# EAGLE design USB C Vertical Breakout-PTH (EAGLE 9.6.2)
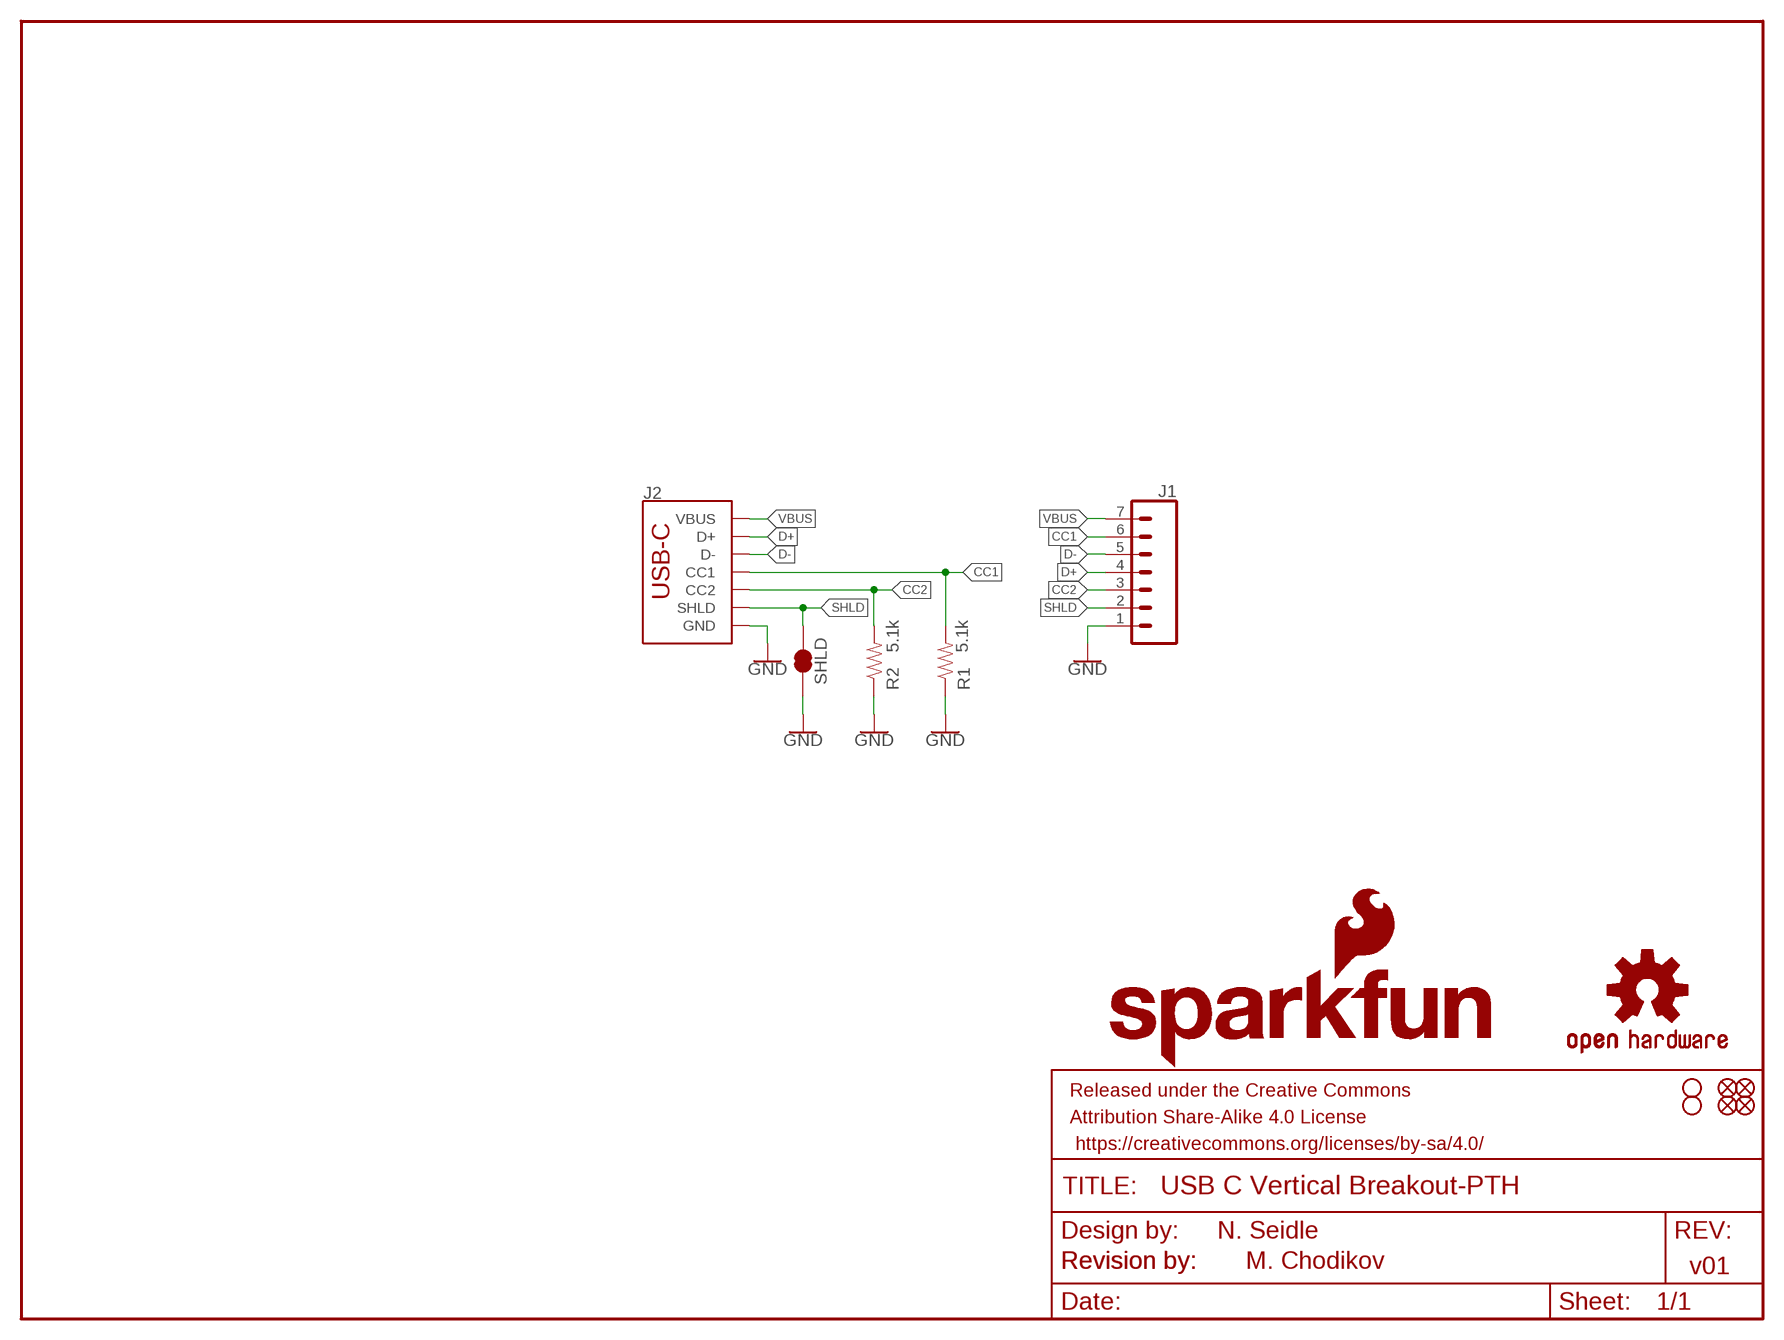
[diagram p0: schematic, sheet 1]

## Parts
FD1  FIDUCIALUFIDUCIAL  [FIDUCIAL-MICRO]
FD2  FIDUCIALUFIDUCIAL  [FIDUCIAL-MICRO]
FD3  FIDUCIALUFIDUCIAL  [FIDUCIAL-MICRO]
FD4  FIDUCIALUFIDUCIAL  [FIDUCIAL-MICRO]
FRAME2  FRAME-LETTER  [CREATIVE_COMMONS]
H1  STAND-OFFTIGHT  [STAND-OFF-TIGHT]
H2  STAND-OFFTIGHT  [STAND-OFF-TIGHT]
J1  CONN_07NO_SILK  [1X07_NO_SILK]
J2  USB_C_2-LAYER-VERTICAL-PTH  [USB-C-8P-2LAYER-VERTICAL-PTH]
LOGO1  SFE_LOGO_NAME_FLAMEBLANK  [BLANK]
LOGO2  OSHW-LOGOMINI  [OSHW-LOGO-MINI]
LOGO3  SFE_LOGO_FLAME.1_INCH  [SFE_LOGO_FLAME_.1]
R1  5.1k  5.1KOHM5.1KOHM-0603-1/10W-1%  [0603]
R2  5.1k  5.1KOHM5.1KOHM-0603-1/10W-1%  [0603]
SHLD  SHLD  JUMPER-SMT_2_NC_TRACE_NO-SILK  [SMT-JUMPER_2_NC_TRACE_NO-SILK]

## Nets
CC1: J1.6 J2.A5(CC1) R1.2
CC2: J1.3 J2.B5(CC2) R2.2
D+: J1.4 J2.A6(D+) J2.B6(D+)
D-: J1.5 J2.A7(D-) J2.B7(D-)
GND: J1.1 J2.A1(GND) J2.A12(GND) J2.B1(GND) J2.B12(GND) R1.1 R2.1 SHLD.1
SHLD: J1.2 J2.SHLD1(SHLD) J2.SHLD2(SHLD) J2.SHLD3(SHLD) J2.SHLD4(SHLD) SHLD.2
VBUS: J1.7 J2.A4(VBUS) J2.A9(VBUS) J2.B4(VBUS) J2.B9(VBUS)

## Notes on the sheet
- N. Seidle
- Revision by: | Revision by: | M. Chodikov | v01

## Library data of the parts
FD1-FD4 = SparkFun-Aesthetics:FIDUCIAL: Fiducial Alignment Points Point-of-reference for pick-and-place machines and other optical instruments.
FRAME2 = SparkFun-Aesthetics:FRAME-LETTER: Schematic Frame - Letter Standard 8.5x11 US Letter frame
H1 H2 = SparkFun-Hardware:STAND-OFF: Stand Off Drill holes for mechanically mounting via screws, standoffs, etc. Note: Use the keepout ring to avoid running the screw head into surrounding components. Variant Overviews STAND-OFF - Mechanical footprint for a #4 phillips button head screw. STAND-OFF-TIGHT - Mechanical footprint for a #4 phillips button head screw, Example SparkFun Products Screw - Phillips Head (1/4", 4-40, 10 pack) <https://www.sparkfun.com/products/10453> (PRT-10453) Screw - Phillips Head (1/2", 4-40, 10 pack) <https://www.sparkfun.com/products/10452> (PRT-10452) Screw - Phillips Head (3/4", 4-40, 10 pack) <https://www.sparkfun.com/products/10451> (PRT-10451) Screw - Phillips Head (1", 4-40, 10 pack) <https://www.sparkfun.com/products/10450> (PRT-10450)
J1 = SparkFun-Connectors:CONN_07: Multi connection point. Often used as Generic Header-pin footprint for 0.1 inch spaced/style header connections On any of the 0.1 inch spaced packages, you can populate with these: Break Away Headers - Straight <https://www.sparkfun.com/products/116> (PRT-00116) Break Away Male Headers - Right Angle <https://www.sparkfun.com/products/553> (PRT-00553) Female Headers <https://www.sparkfun.com/products/115> (PRT-00115) Break Away Headers - Machine Pin <https://www.sparkfun.com/products/117> (PRT-00117) Break Away Female Headers - Swiss Machine Pin <https://www.sparkfun.com/products/743> (PRT-00743) For SCREWTERMINALS and SPRING TERMINALS visit here: Screw Terimnals on SparkFun.com <https://www.sparkfun.com/search/results?term=Screw+Terminals> (5mm/3.5mm/2.54mm spacing) This device is also useful as a general connection point to wire up your design to another part of your project. Our various solder wires solder well into these plated through hole pads. Hook-Up Wire - Assortment (Stranded, 22 AWG) <https://www.sparkfun.com/products/11375> (PRT-11375) Hook-Up Wire - Assortment (Solid Core, 22 AWG) <https://www.sparkfun.com/products/11367> (PRT-11367) View the entire wire category on our website here <https://www.sparkfun.com/categories/141> Special notes: Molex polarized connector foot print use with SKU : PRT-08231 with associated crimp pins and housings. 1MM SMD Version SKU: PRT-10208 NOTES ON THE VARIANTS LOCK and LOCK_LONGPADS... This footprint was designed to help hold the alignment of a through-hole component (i.e. 6-pin header) while soldering it into place. You may notice that each hole has been shifted either up or down by 0.005 of an inch from it's more standard position (which is a perfectly straight line). This slight alteration caused the pins (the squares in the middle) to touch the edges of the holes. Because they are alternating, it causes a "brace" to hold the component in place. 0.005 has proven to be the perfect amount of "off-center" position when using our standard breakaway headers. Although looks a little odd when you look at the bare footprint, once you have a header in there, the alteration is very hard to notice. Also,if you push a header all the way into place, it is covered up entirely on the bottom side.
J2 = USB-C_Vertical:USB_C: USB Type C 14Pin Connector D1 and D2 are tied together enabling D+/- no matter which way the cable is plugged into the connector. The two channel configuration pins (CC1/2) are exposed. These are normally connected to ground via 5.1k resistors but can be reconfigured for high current/high power applications. **4-LAYER BOARD WARNING!!** If designing 4-layer board, make sure to select the variant _4-LAYER-ISOLATED. The linked footprint (USB-C-16-4LAYER-ISOLATED) includes some very necessary cutout polygons in the inner layers (2 and 15). This prevents the PTH mounting shield legs on the USB connector from electrically connecting any other polygons on the inner layers (usually VCC and GND).; PROD_ID: CONN-19461
LOGO1 = SparkFun-Aesthetics:SFE_LOGO_NAME_FLAME: SparkFun Font Logo w/ Flame This is the SparkFun full logo. The logo on the schematic will always be the same size; the package variant is the height of the flame part of the logo. Default layer for the logo on the board is tSilk.
LOGO2 = SparkFun-Aesthetics:OSHW-LOGO: Open-Source Hardware (OSHW) Logo This logo indicates the piece of hardware it is found on incorporates a OSHW license and/or adheres to the definition of open source hardware found here: http://freedomdefined.org/OSHW
LOGO3 = SparkFun-Aesthetics:SFE_LOGO_FLAME: SparkFun Flame Logo This is the SparkFun flame logo. The logo on the schematic will always be the same size; the package variant is the height of the flame. Default layer for the logo on the board is tSilk.
R1 R2 = SparkFun-Resistors:5.1KOHM; PROD_ID: RES-12083
SHLD = SparkFun-Jumpers:JUMPER-SMT_2_NC_TRACE: Normally closed trace jumper This jumper has a trace between two pads so it's normally closed (NC). Use a razor knife to open the connection. For best results follow the IPC guidelines for cutting traces: Cutout at least 0.063 mm (0.005 in). Remove all loose material to clean up the cut area. Seal the cut with an approved epoxy. Reapply solder to reclose the connection.

## Net classes
0 default: width 0 mm, drill 0 mm
1 power: width 0.178 mm

## Board
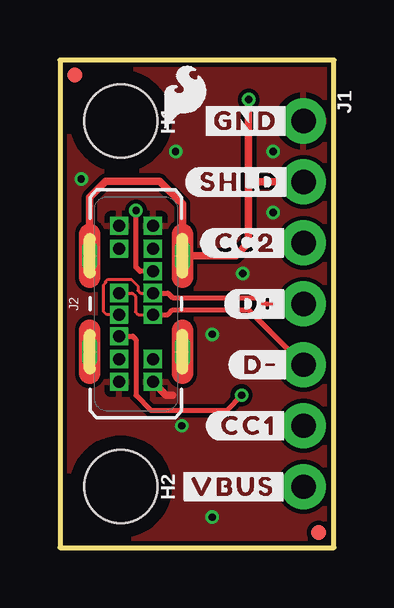
[diagram p1: board, top side]
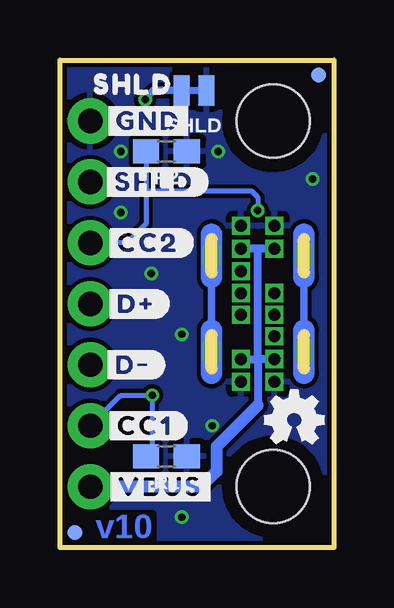
[diagram p2: board, bottom side, seen from below]

Size 11.43 x 20.32 mm. Coordinates in mm from the lower left corner, seen from the top.
Outline: 0,0 11.43,0 11.43,20.32 0,20.32 0,0
Copper layers (1*16): Top/Horz 0.035mm / dielectric 1.5mm / Bottom/Vert 0.035mm
Design rules "SparkFun-2-Layer-Minimum-JLCPCB": minimum track width 5mil, minimum drill 0.3mm, track to track 5mil, track to pad 5mil, pad to pad 5mil, via to via 5mil, smd to smd 5mil, copper to edge 7mil, drill to drill 7mil, minimum pad ring 5mil, minimum via ring 5mil, stop-mask expansion 2.5mil, vias tented up to drill 25mil, thermal gap 10mil

### Footprints (pad centres in the part's own frame; a part is rotated, then mirrored left to right if it is on the bottom)
FIDUCIAL-MICRO = smd 0.635 x 0.635: 1 0,0
STAND-OFF-TIGHT = hole 3.048: 0,0
1X07_NO_SILK = drill 1.016 pad 1.88: 1 0,0; 2 2.54,0; 3 5.08,0; 4 7.62,0; 5 10.16,0; 6 12.7,0; 7 15.24,0
USB-C-8P-2LAYER-VERTICAL-PTH = drill 0.5 pad 0.65 square: A1 -3.25,0.7; A4 -2.3,0.7; A5 -1.35,0.7; A6 -0.45,0.7; A7 0.45,0.7; A9 2.3,0.7; A12 3.25,0.7; B1 3.25,-0.7; B4 2.3,-0.7; B5 1.35,-0.7; B6 0.45,-0.7; B7 -0.45,-0.7; B9 -2.3,-0.7; B12 -3.25,-0.7 | drill 0.4 pad 0.6 long: SHLD1 -2,1.93; SHLD2 2,1.93; SHLD3 2,-1.93; SHLD4 -2,-1.93
0603 = smd 1.1 x 1: 1 -0.85,0; 2 0.85,0
SMT-JUMPER_2_NC_TRACE_NO-SILK = smd 0.66 x 1.27: 1 -0.521,0; 2 0.521,0

### Placement (x,y rotation side)
FD1  0.64,19.68 90 top
FD2  0.64,19.68 90 bottom
FD3  10.79,0.64 270 top
FD4  10.79,0.64 90 bottom
FRAME2  -20.32,-35.56 0 top  (outside the outline)
H1  2.54,17.78 270 top
H2  2.54,2.54 270 top
J1  10.16,17.78 270 top
J2  3.17,10.16 90 top
LOGO1  8.89,1.27 180 top
LOGO2  1.65,5.33 0 bottom
LOGO3  5.21,18.8 0 top
R1  6.99,3.81 180 bottom
R2  6.99,16.51 180 bottom
SHLD  5.84,19.05 180 bottom
U$1  [SHLD0]  8.38,19.3 0 bottom
U$4  [#D##3]  8.26,10.16 0 top
U$7  [#D##4]  8.38,7.62 0 top
U$10  [#GND#6]  7.75,17.78 0 top
U$16  [#CC2#0]  7.75,12.7 0 top
U$17  [#CC1#5]  7.87,5.08 0 top
U$18  [#SHLD#5]  7.49,15.24 0 top
U$19  [#VBUS#7]  7.24,2.54 0 top
U$20  [#VBUS#7]  7.24,2.54 0 bottom
U$21  [#GND#6]  7.75,17.78 0 bottom
U$22  [#SHLD#8]  7.49,15.24 0 bottom
U$23  [#CC2#9]  7.75,12.7 0 bottom
U$24  [#D##9]  8.26,10.16 0 bottom
U$25  [#D##10]  8.38,7.62 0 bottom
U$26  [#CC1#11]  7.87,5.08 0 bottom
U$59  [ORDERING_INSTRUCTIONS]  40.64,50.8 0 top  (outside the outline)

### Tracks (layer width: path | path; a pad name or v marks a point on that pad's centre or on a via)
CC1  (via drill 0.3)
  Top/Horz 0.203: J2.A5 3.03,8.81 3.17,8.67 3.17,6.35 3.81,5.71 6.95,5.71 v7.58,6.35
  Bottom/Vert 0.203: J1.6 8.89,6.35 v7.58,6.35 7.58,4.06 R1.2
CC2  (via drill 0.3)
  Top/Horz 0.203: J2.B5 3.34,11.51 3.17,11.68 v3.17,14.05
  Bottom/Vert 0.203: v3.17,14.05 3.17,14.61 3.43,14.86 7.83,14.86 | J1.3 8.64,12.7 7.83,13.5 7.83,14.86 | R2.2 7.83,14.86
D+
  Top/Horz 0.127: J2.A6 1.95,9.71 1.83,9.83 1.83,10.96 1.91,11.04 1.91,11.09 1.99,11.18 2.97,11.18 3.25,10.9 3.25,10.73 3.37,10.61 J2.B6
  Top/Horz 0.203: J2.B6 4.5,10.61 4.7,10.41 8.26,10.41 8.51,10.16 J1.4
D-
  Top/Horz 0.127: J2.A7 3.01,10.61 3.15,10.47 3.15,9.83 3.27,9.71 J2.B7
  Top/Horz 0.203: J2.B7 4.5,9.71 4.7,9.91 7.87,9.91 J1.5
GND  (via drill 0.3)
  Top/Horz 0.305: J2.B12 4.43,6.35 4.7,6.35
  other vias: 4.83,16.51 6.35,8.89 6.35,1.27 8.89,16.51 8.89,13.97 7.62,11.43 5.08,5.08 0.89,15.37
  pour Bottom/Vert (isolate 0.178): 0,0 11.43,0 11.43,20.32 0,20.32
  pour Top/Horz (isolate 0.178): 0,0 11.43,0 11.43,20.32 0,20.32
SHLD  (via drill 0.3)
  Top/Horz 0.305: J2.SHLD2 1.25,14.61 1.91,15.27 4.17,15.27 5.11,14.33 J2.SHLD3 7.33,12.16 7.87,12.7 7.87,15.24 | v7.87,18.67 7.87,15.24 | J1.2 7.87,15.24
  Bottom/Vert 0.305: v7.87,18.67 7.87,18.69 7.52,19.05 SHLD.2 | J2.SHLD1 J2.SHLD2 | J2.SHLD4 J2.SHLD3
VBUS
  Bottom/Vert 0.33: J2.A9 3.17,12.46 | 3.17,12.46 J2.B4 | J2.A4 3.17,7.86 | 3.17,7.86 3.17,12.46 | J2.B9 3.17,7.86 | 3.17,7.86 3.17,5.93
  Bottom/Vert 0.508: 3.17,5.93 4.9,4.21 4.9,3.18 5.54,2.54 J1.7

### Text on the board
Bottom/Vert: v10
Measures: Units in inches
tDocu: Solder Mask: Red / Thickness: 1.6mm / Two layer design / Finish: HASL Lead-Free / Copper Weight: 1oz / Material: TG135-140 | N. Seidle | Revision By: | M. Chodikov